# Altium schematic sheet Touch Sensing.SchDoc: Touch Sensing
size A4; DocumentNumber: MB1144; Revision: C-02; SheetNumber: 17; SheetTotal: 25; Project: STM32L476G-EVAL; ModifiedDate: 9/23/2015
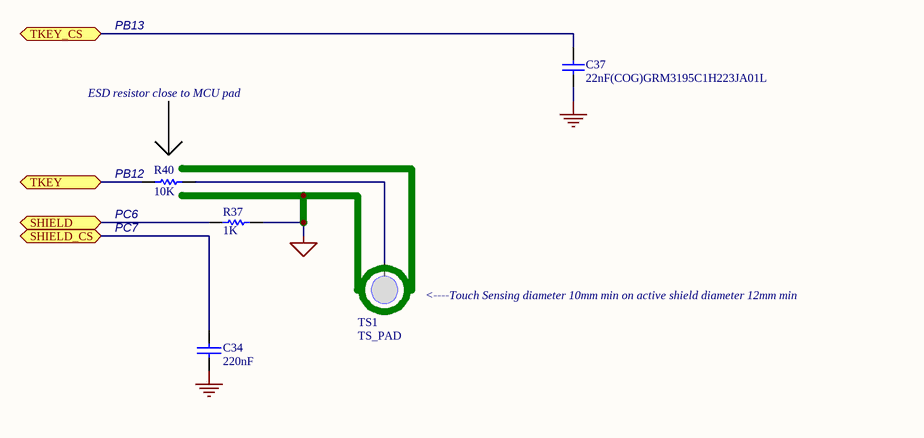
[diagram p0: Touch Sensing.SchDoc]

## Parts
C34  220nF  [0603C]
C37  22nF(COG)GRM3195C1H223JA01L  [1206C]
R37  1K  [0402R]
R40  10K  [0402R]
TS1  TS_PAD  [TS_PAD]

## Ports
SHIELD, SHIELD_CS, TKEY, TKEY_CS

## Nets
GND: C34.1 C37.1
TS_SHIELD: R37.2
SHIELD: R37.1 ; port SHIELD
SHIELD_CS: C34.2 ; port SHIELD_CS
TKEY: R40.1 ; port TKEY
TKEY_CS: C37.2 ; port TKEY_CS
NetR40_2: R40.2 TS1.1

## Notes on the sheet
- PB13
- ESD resistor close to MCU pad
- (near R40) PB12
- (near R40) PC6
- (near R40) PC7
- (near TS1) <----Touch Sensing diameter 10mm min on active shield diameter 12mm min
- Title:
- Project:
- Size:
- Date:
- A4
- Reference:
- Sheet:
- Revision:
- of

## Library data of the parts
C34 = CAP: Capacitor; Ordered by: Subcon; ECCN_US/EU: NA
C37 = CAP: Capacitor; Value: 100pF; Ordered by: Subcon; ECCN_US/EU: NA; Published: 8-Jun-2000; Revision: July-2002: Re-released for DXP Platform.; Publisher: Altium Limited
R37 = Res1: Resistor; Ordered by: Subcon; ECCN_US/EU: NA; Published: 8-Jun-2000; Revision: July-2002: Re-released for DXP Platform.; Publisher: Altium Limited; Value: 1K
R40 = Res1: Resistor; Value: 1K; Ordered by: Subcon; ECCN_US/EU: NA; Published: 8-Jun-2000; Revision: July-2002: Re-released for DXP Platform.; Publisher: Altium Limited
TS1 = TS_PAD: Ordered by: Subcon; ECCN_US/EU: NA; Assembly: with transparent plastic cover; Comments: touch sensing button